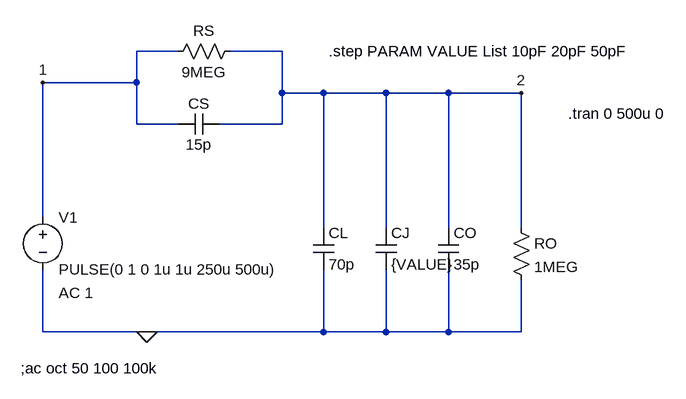
[diagram p0: schematic Vorbereitung.asc]
Vorbereitung.asc, the LTspice schematic file:
Version 4
SHEET 1 880 680
WIRE -128 -256 -192 -256
WIRE 32 -256 -48 -256
WIRE -192 -208 -192 -256
WIRE -192 -208 -336 -208
WIRE 32 -192 32 -256
WIRE 96 -192 32 -192
WIRE 192 -192 96 -192
WIRE 288 -192 192 -192
WIRE 400 -192 288 -192
WIRE -192 -144 -192 -208
WIRE -128 -144 -192 -144
WIRE 32 -144 32 -192
WIRE 32 -144 -64 -144
WIRE -336 0 -336 -208
WIRE 96 16 96 -192
WIRE 192 16 192 -192
WIRE 288 16 288 -192
WIRE 400 16 400 -192
WIRE -336 176 -336 80
WIRE -176 176 -336 176
WIRE 96 176 96 80
WIRE 96 176 -176 176
WIRE 192 176 192 80
WIRE 192 176 96 176
WIRE 288 176 288 80
WIRE 288 176 192 176
WIRE 400 176 400 96
WIRE 400 176 288 176
FLAG -176 176 0
FLAG -336 -208 1
FLAG 400 -192 2
SYMBOL res 384 0 R0
SYMATTR InstName RO
SYMATTR Value 1MEG
SYMBOL res -32 -272 R90
WINDOW 0 0 56 VBottom 0
WINDOW 3 32 56 VTop 0
SYMATTR InstName RS
SYMATTR Value 9MEG
SYMBOL cap -64 -160 R90
WINDOW 0 0 32 VBottom 0
WINDOW 3 32 32 VTop 0
SYMATTR InstName CS
SYMATTR Value 15p
SYMBOL cap 272 16 R0
SYMATTR InstName CO
SYMATTR Value 35p
SYMBOL cap 176 16 R0
SYMATTR InstName CJ
SYMATTR Value {VALUE}
SYMBOL cap 80 16 R0
SYMATTR InstName CL
SYMATTR Value 70p
SYMBOL voltage -336 -16 R0
WINDOW 123 24 132 Left 0
WINDOW 39 0 0 Left 0
SYMATTR InstName V1
SYMATTR Value PULSE(0 1 0 1u 1u 250u 500u)
SYMATTR Value2 AC 1
TEXT 104 -256 Left 0 !.step PARAM VALUE List 10pF 20pF 50pF
TEXT -370 232 Left 0 !;ac oct 50 100 100k
TEXT 472 -160 Left 0 !.tran 0 500u 0

The netlist it stands for:
* Vorbereitung.asc
RO 2 0 1MEG
RS 2 1 9MEG
CS 2 1 15p
CO 2 0 35p
CJ 2 0 {VALUE}
CL 2 0 70p
V1 1 0 PULSE(0 1 0 1u 1u 250u 500u) AC 1
.step PARAM VALUE List 10pF 20pF 50pF
;ac oct 50 100 100k
.tran 0 500u 0
.backanno
.end